# Altium schematic sheet CAN_Interface.SchDoc
size A4; SheetNumber: 1; SheetTotal: 4
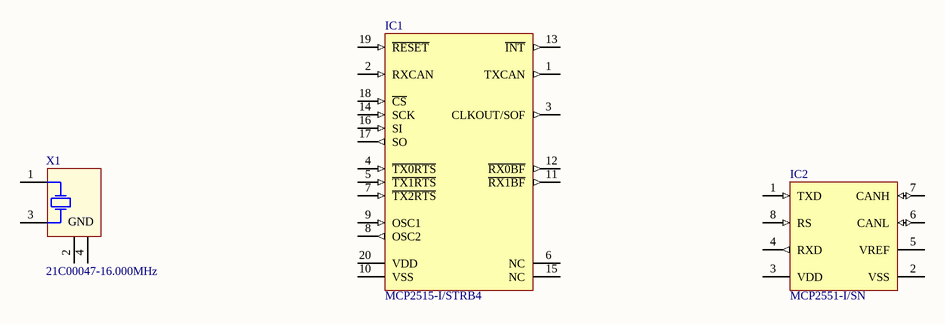
[diagram p0: CAN_Interface.SchDoc]

## Parts
IC1  MCP2515-I/STRB4  [TSSOP-ST20_N]
IC2  MCP2551-I/SN  [MCHP-SN8_V]
X1  21C00047-16.000MHz  [ITTI-21C00047-16.000MHz-4_V]

## Nets

Not connected (* = marked no-connect by the designer): IC1 1(TXCAN) 2(RXCAN) 3(CLKOUT/SOF) 4(~{TX0RTS}) 5(~{TX1RTS}) 6(NC) 7(~{TX2RTS}) 8(OSC2) 9(OSC1) 10(VSS) 11(~{RX1BF}) 12(~{RX0BF}) 13(~{INT}) 14(SCK) 15(NC) 16(SI) 17(SO) 18(~{CS}) 19(~{RESET}) 20(VDD); IC2 1(TXD) 2(VSS) 3(VDD) 4(RXD) 5(VREF) 6(CANL) 7(CANH) 8(RS); X1 1(XTAL) 2(GND) 3(XTAL) 4(GND)

## Library data of the parts
IC1 = CMP-0186-00268-1: Stand-Alone CAN Controller With SPI Interface, 20-Pin TSSOP, Industrial Temperature; Code_JEDEC: MO-153-AC; ComponentLink2URL: http://ww1.microchip.com/downloads/en/DeviceDoc/21801F.pdf; ComponentLink3URL: http://www.microchip.com/stellent/groups/techpub_sg/documents/packagingspec/en012702.pdf; PackageReference: TSSOP-ST20; PackageDescription: 20-Lead Plastic Thin Shrink Small Outline (ST) - 4.4mm Body [TSSOP]; ComponentLink3Description: Package Specification; ComponentLink2Description: Datasheet; PackageVersion: revBB, Aug-2009; DatasheetVersion: revF, Oct-2010; ComponentLink1Description: Manufacturer URL; ComponentLink1URL: http://www.microchip.com/
IC2 = CMP-0186-00138-3: High-Speed CAN Transceiver, / 1 Mb/s, 4.5 to 5.5 V, 8-Pin SOIC (SN), Industrial Temperature, RoHS, Tube; Manufacturer: Microchip; RoHSCompliant: true; PackageReference: SN8; ComponentLink1URL: http://www.microchip.com/; DatasheetVersion: Rev. F, 07/2010; ComponentLink2Description: Datasheet; ComponentLink2URL: http://ww1.microchip.com/downloads/en/DeviceDoc/21667f.pdf; ComponentLink3Description: Package Specification; PackageDescription: 8-Pin Small Outline Integrated Circuit, Body 4.9 x 3.9 mm, Pitch 1.27 mm; ComponentLink1Description: Manufacturer URL; Mounting Technology: Surface Mount; ComponentLink3URL: http://www.microchip.com/stellent/groups/techpub_sg/documents/packagingspec/en012702.pdf
X1 = CMP-0464-00001-2: Crystal, 16 MHz, -30 to 85 degC, 3.2 x 2.5 x 0.9 mm SMD; Manufacturer: ITTI; Frequency Tolerance: +/-20 ppm; Load Capacitance: 10 pF; Drive Level: 100 max. uw; Nominal Frequency: 16 MHz; Overtone order: Fundamental; ComponentLink1Description: Manufacturer URL; PackageDescription: 4-Pin Hand Drawn, Body 3.2 x 2.5mm; ComponentLink1URL: http://www.itti-co.com; PartNumber: 21C00047-16.000MHz; Operating temperature: -30 to 85 degC; PackageReference: 21C00047-16.000MHz-4; Mounting Technology: Surface Mount; Manufacturer Part Number: 21C00047-16.000MHZ